# Altium schematic sheet STM32_SIM800C.SchDoc: Module Sim900A STM32
size A1
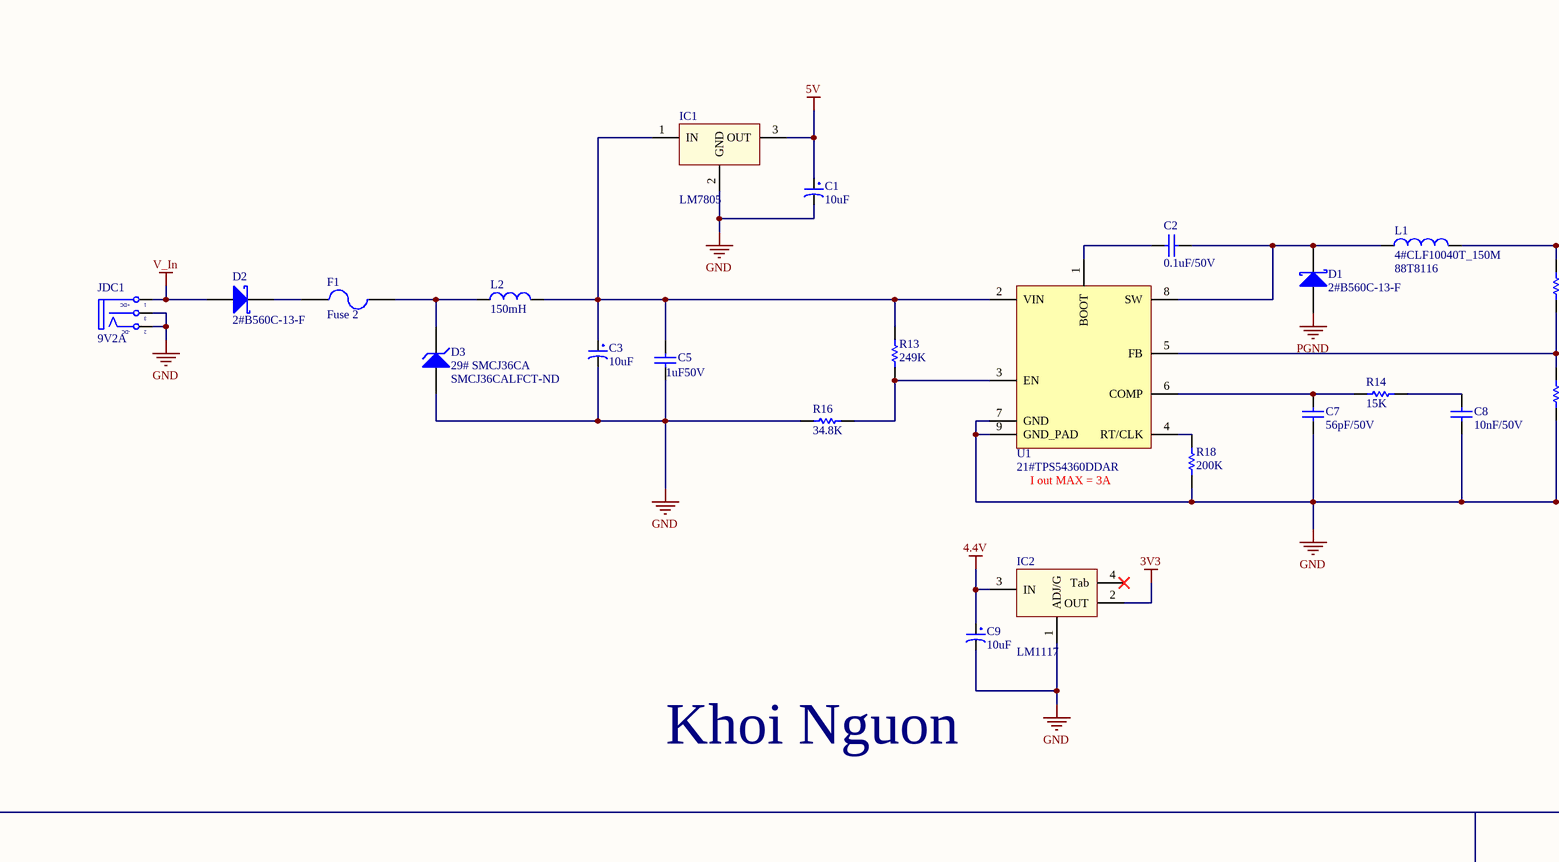
[diagram p0: STM32_SIM800C.SchDoc, top left]
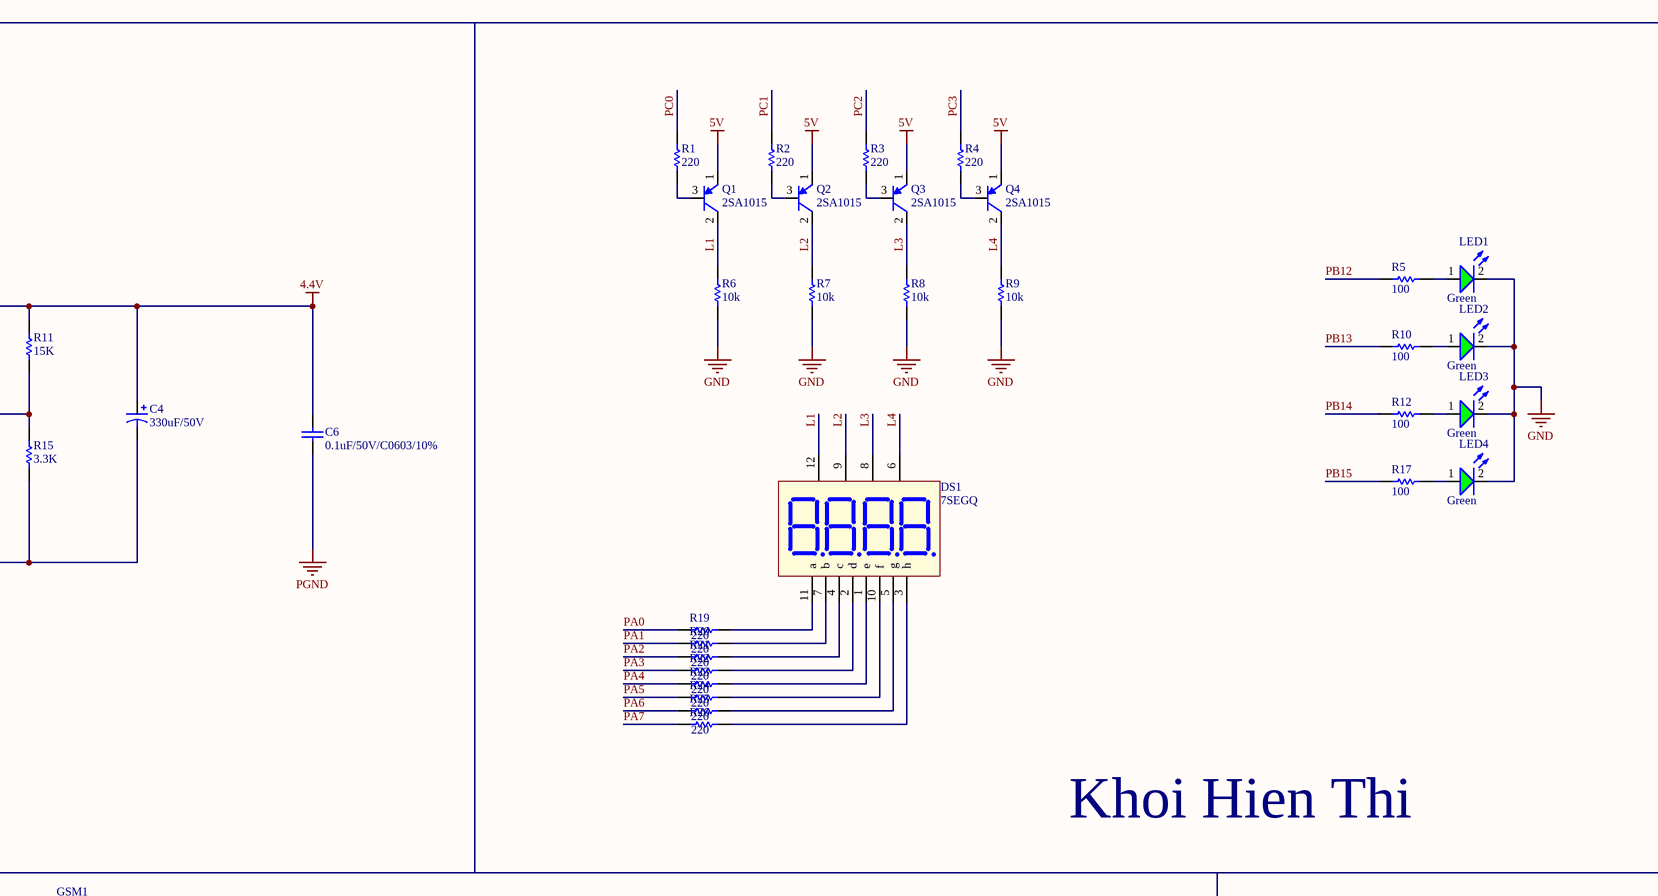
[diagram p1: STM32_SIM800C.SchDoc, top right]
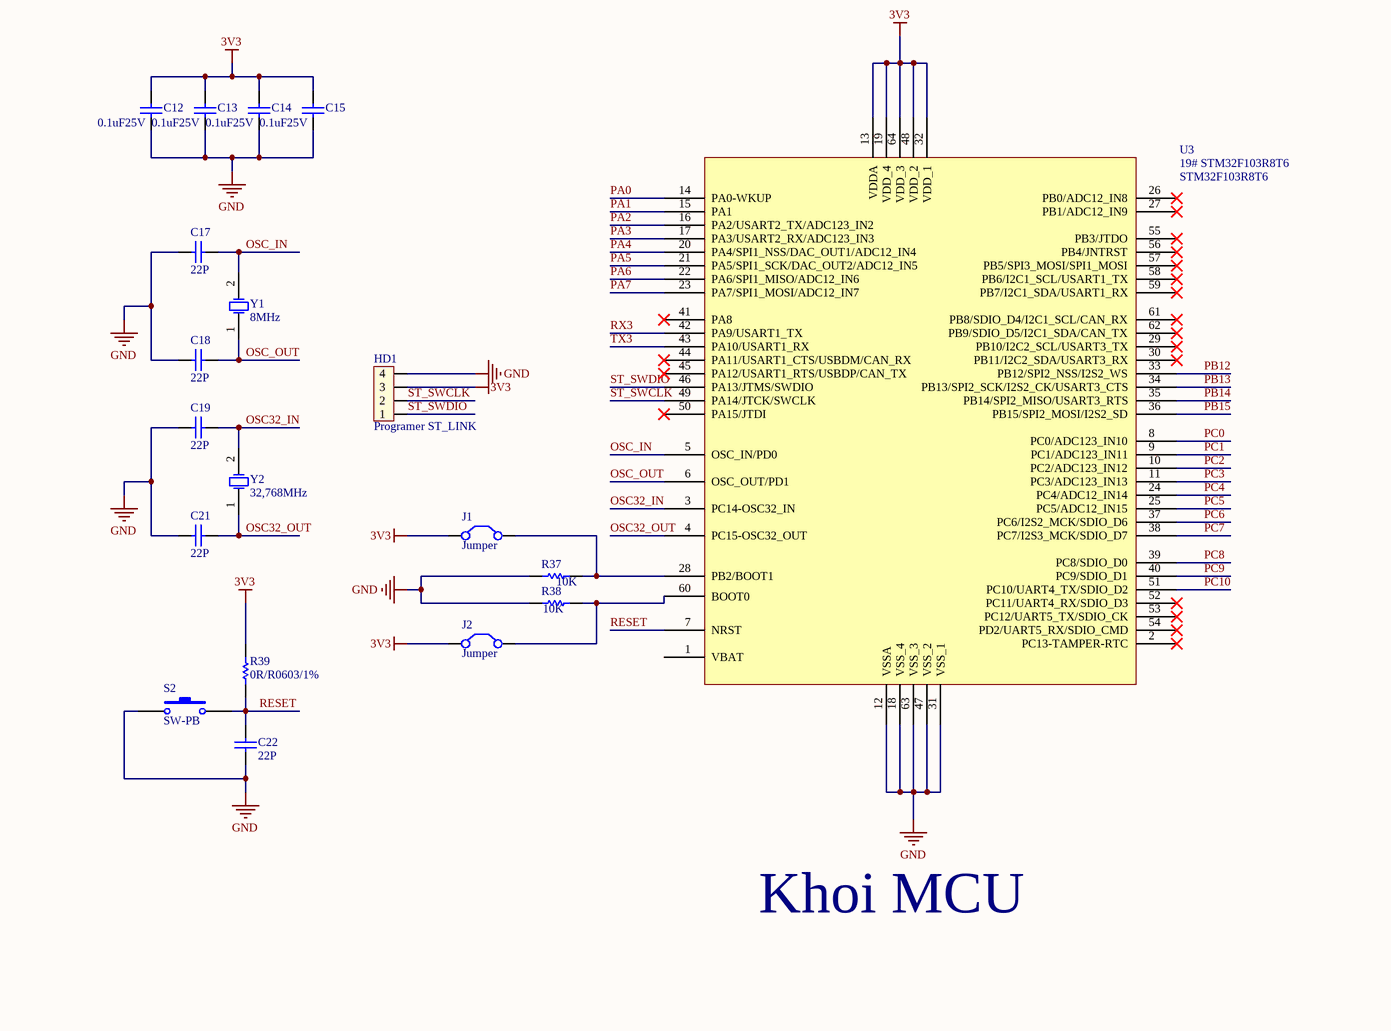
[diagram p2: STM32_SIM800C.SchDoc, bottom left]
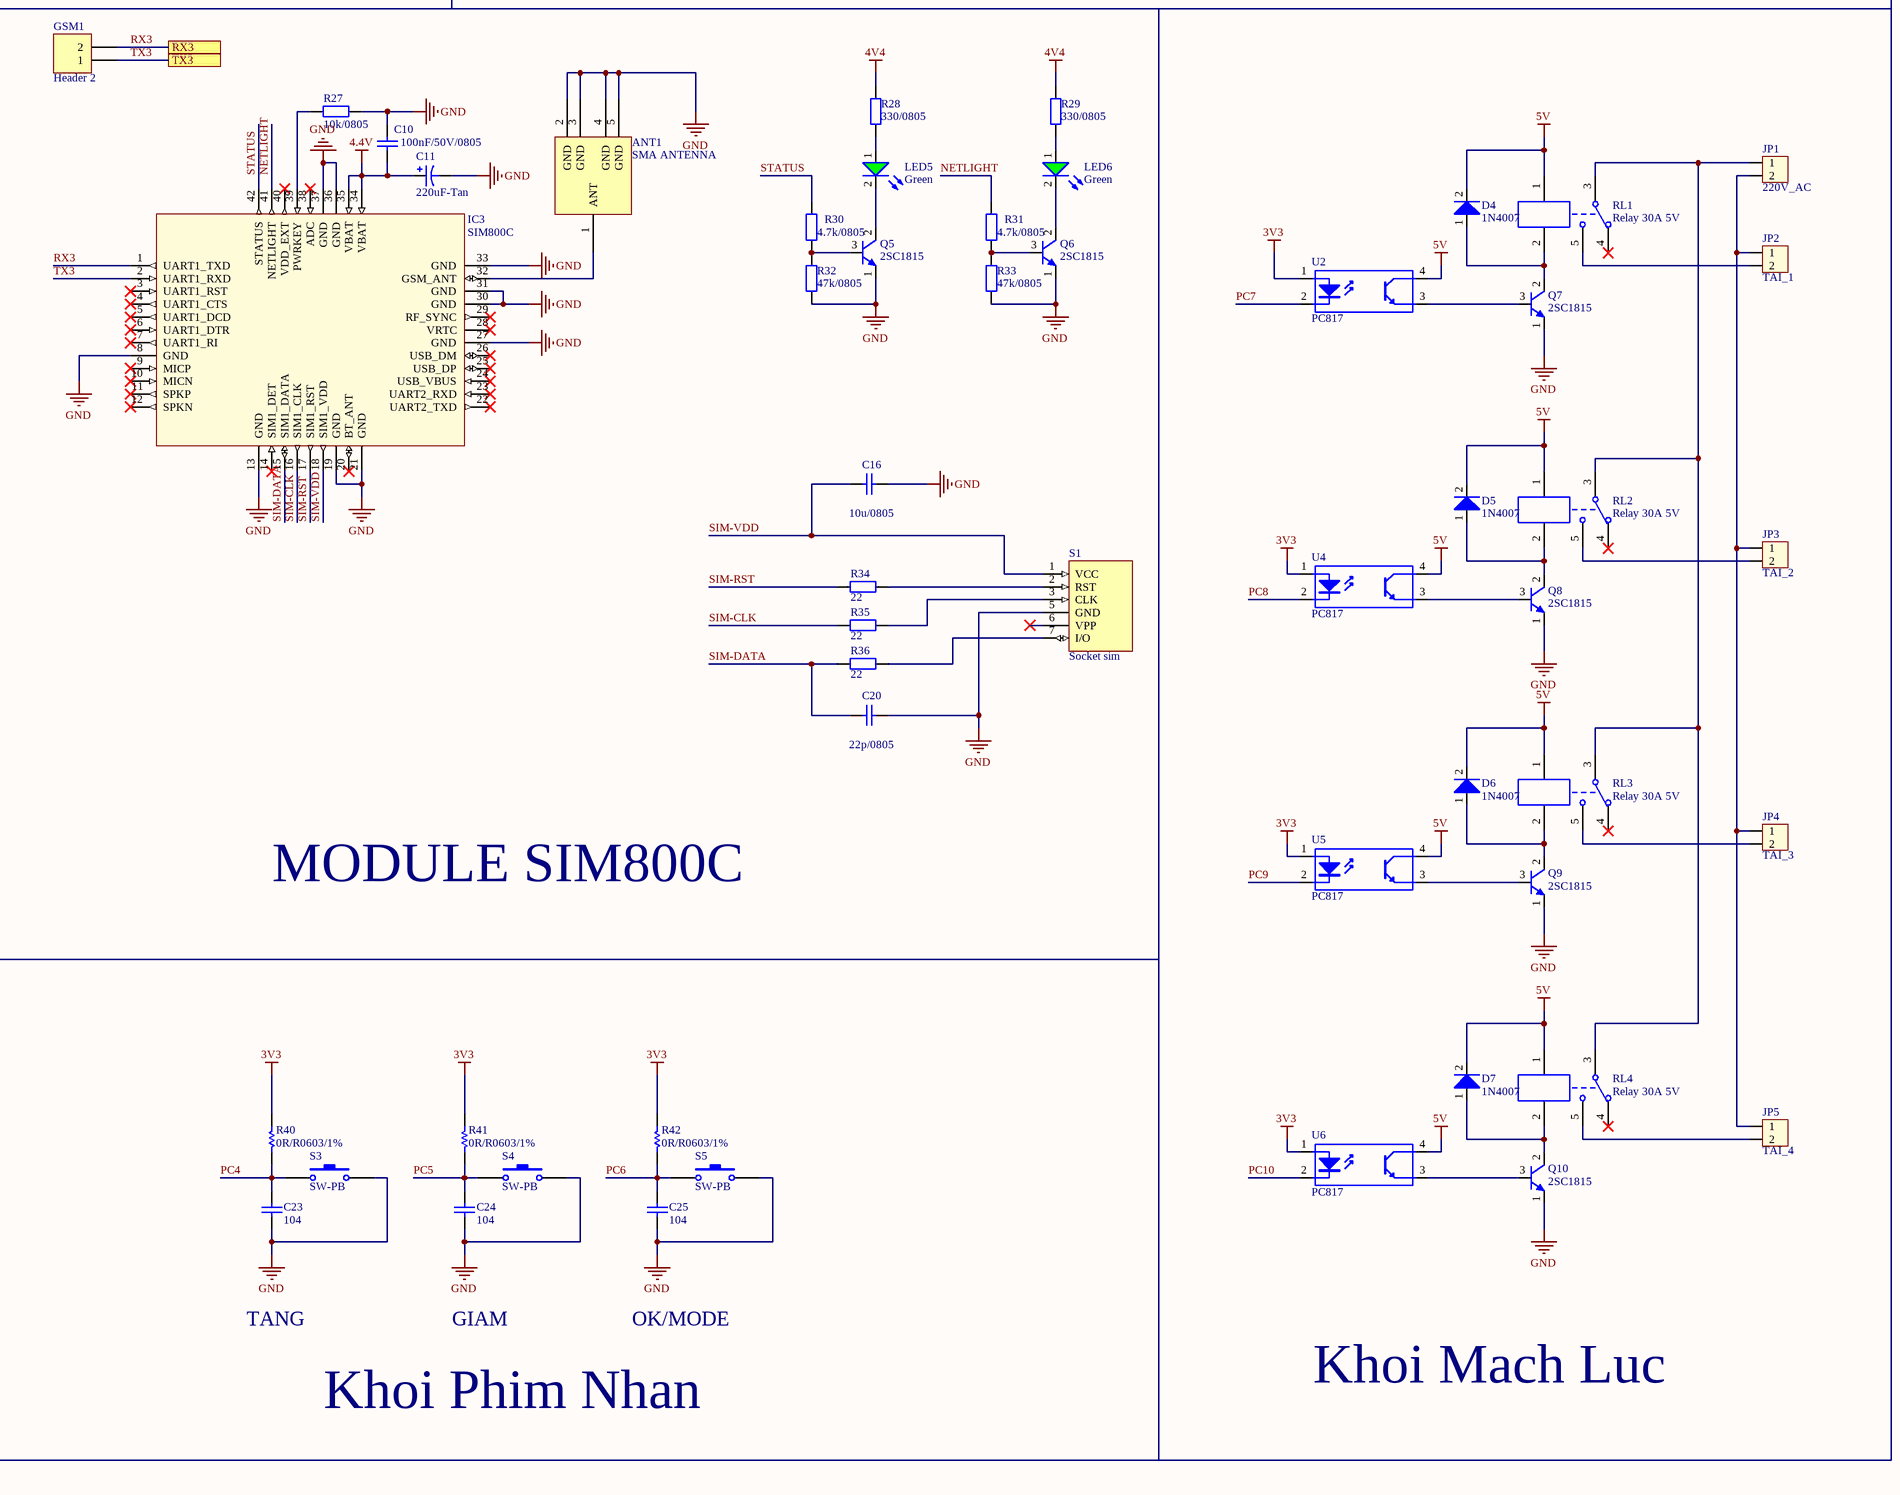
[diagram p3: STM32_SIM800C.SchDoc, bottom right]

## Parts
ANT1  SMA ANTENNA  [ANT-SMA-ST-F]
C1  10uF  [CP1/2]
C2  0.1uF/50V  [Cap Ceramic 0603 SMD]
C3  10uF  [CP1/2]
C4  330uF/50V  [CAP ALU CASE G SMD]
C5  1uF50V  [Cap Ceramic 0603 SMD]
C6  0.1uF/50V/C0603/10%  [Cap Ceramic 0603 SMD]
C7  56pF/50V  [Cap Ceramic 0603 SMD]
C8  10nF/50V  [Cap Ceramic 0603 SMD]
C9  10uF  [CP1/2]
C10  100nF/50V/0805  [C0805-2012]
C11  220uF-Tan  [CAP_TANTA_10UF_35V]
C12  0.1uF25V  [Cap Ceramic 0603 SMD]
C13  0.1uF25V  [Cap Ceramic 0603 SMD]
C14  0.1uF25V  [Cap Ceramic 0603 SMD]
C15  0.1uF25V  [Cap Ceramic 0603 SMD]
C16  10u/0805  [C0805-2012]
C17  22P  [Cap Ceramic 0603 SMD]
C18  22P  [Cap Ceramic 0603 SMD]
C19  22P  [Cap Ceramic 0603 SMD]
C20  22p/0805  [C0805-2012]
C21  22P  [Cap Ceramic 0603 SMD]
C22  22P  [Cap Ceramic 0603 SMD]
C23  104  [Cap Ceramic 0603 SMD]
C24  104  [Cap Ceramic 0603 SMD]
C25  104  [Cap Ceramic 0603 SMD]
D1  2#B560C-13-F  [2# B560C]
D2  2#B560C-13-F  [2# B560C]
D3  29# SMCJ36CA  Supplier Part Number 1: SMCJ36CALFCT-ND  [29# diode SMCJ36A]
D4  1N4007  [1N4007]
D5  1N4007  [1N4007]
D6  1N4007  [1N4007]
D7  1N4007  [1N4007]
DS1  7SEGQ  [7SEGQ]
F1  Fuse 2  [PIN-W2/E2.8]
GSM1  Header 2  [Header_2]
HD1  Programer ST_LINK  [Header_4]
IC1  LM7805  [QTO-220]
IC2  LM1117  [SOT223-4N]
IC3  SIM800C  [SIM800C]
J1  Jumper  [Header_2]
J2  Jumper  [Header_2]
JDC1  9V2A  [DC-IN]
JP1  220V_AC  [DOMINO_OSTTC_2P]
JP2  TAI_1  [DOMINO_OSTTC_2P]
JP3  TAI_2  [DOMINO_OSTTC_2P]
JP4  TAI_3  [DOMINO_OSTTC_2P]
JP5  TAI_4  [DOMINO_OSTTC_2P]
L1  4#CLF10040T_150M  Supplier Part Number 1: 88T8116  [4# clf10040XX]
L2  150mH  [L/0.4]
LED1  value Green  [LED5G]  (hidden comment: LT0054)
LED2  value Green  [LED5G]  (hidden comment: LT0054)
LED3  value Green  [LED5G]  (hidden comment: LT0054)
LED4  value Green  [LED5G]  (hidden comment: LT0054)
LED5  value Green  [LED5G]  (hidden comment: LT0054)
LED6  value Green  [LED5G]  (hidden comment: LT0054)
Q1  2SA1015  [2SA1015]
Q2  2SA1015  [2SA1015]
Q3  2SA1015  [2SA1015]
Q4  2SA1015  [2SA1015]
Q5  2SC1815  [2SC1815]
Q6  2SC1815  [2SC1815]
Q7  2SC1815  [2SC1815]
Q8  2SC1815  [2SC1815]
Q9  2SC1815  [2SC1815]
Q10  2SC1815  [2SC1815]
R1  220  [Res 0603 SMD]
R2  220  [Res 0603 SMD]
R3  220  [Res 0603 SMD]
R4  220  [Res 0603 SMD]
R5  100  [Res 0603 SMD]
R6  10k  [Res 0603 SMD]
R7  10k  [Res 0603 SMD]
R8  10k  [Res 0603 SMD]
R9  10k  [Res 0603 SMD]
R10  100  [Res 0603 SMD]
R11  15K  [Res 0603 SMD]
R12  100  [Res 0603 SMD]
R13  249K  [Res 0805 SMD]
R14  15K  [Res 0603 SMD]
R15  3.3K  [Cap Ceramic 0603 SMD]
R16  34.8K  [Res 0805 SMD]
R17  100  [Res 0603 SMD]
R18  200K  [Res 0603 SMD]
R19  220  [Res 0603 SMD]
R20  220  [Res 0603 SMD]
R21  220  [Res 0603 SMD]
R22  220  [Res 0603 SMD]
R23  220  [Res 0603 SMD]
R24  220  [Res 0603 SMD]
R25  220  [Res 0603 SMD]
R26  220  [Res 0603 SMD]
R27  10k/0805  [RESC2012(0805)]
R28  value 330/0805  [RESC2012(0805)]  (hidden comment: R0805)
R29  value 330/0805  [RESC2012(0805)]  (hidden comment: R0805)
R30  value 4.7k/0805  [RESC2012(0805)]  (hidden comment: R0805)
R31  value 4.7k/0805  [RESC2012(0805)]  (hidden comment: R0805)
R32  value 47k/0805  [RESC2012(0805)]  (hidden comment: R0805)
R33  value 47k/0805  [RESC2012(0805)]  (hidden comment: R0805)
R34  value 22  [RESC2012(0805)]  (hidden comment: R0805)
R35  value 22  [RESC2012(0805)]  (hidden comment: R0805)
R36  value 22  [RESC2012(0805)]  (hidden comment: R0805)
R37  10K  [Res 0603 SMD]
R38  10K  [Res 0603 SMD]
R39  0R/R0603/1%  [Res 0603 SMD]
R40  0R/R0603/1%  [Res 0603 SMD]
R41  0R/R0603/1%  [Res 0603 SMD]
R42  0R/R0603/1%  [Res 0603 SMD]
RL1  Relay 30A 5V  [RL_5V_30A]
RL2  Relay 30A 5V  [RL_5V_30A]
RL3  Relay 30A 5V  [RL_5V_30A]
RL4  Relay 30A 5V  [RL_5V_30A]
S1  Socket sim  [Card Sim]
S2  SW-PB  [SPST-2]
S3  SW-PB  [SPST-2]
S4  SW-PB  [SPST-2]
S5  SW-PB  [SPST-2]
U1  21#TPS54360DDAR  [21# TPS54360]
U2  PC817  [DIP-4]
U3  19# STM32F103R8T6  Supplier Part Number 1: STM32F103R8T6  [19# STMF103R8T6]
U4  PC817  [DIP-4]
U5  PC817  [DIP-4]
U6  PC817  [DIP-4]
Y1  8MHz  [CRYSTAL]
Y2  32,768MHz  [CRYSTAL]

## Ports
RX3, TX3

## Nets
3V3: C12.2 C13.2 C14.2 C15.2 HD1.3 IC2.2(OUT) J1.1(C1) J2.1(C1) R39.2 R40.2 R41.2 R42.2 U2.1(A) U3.13(VDDA) U3.19(VDD_4) U3.32(VDD_1) U3.48(VDD_2) U3.64(VDD_3) U4.1(A) U5.1(A) U6.1(A)
4.4V: C4.1 C6.2 C9.1 C10.1 C11.1 IC2.3(IN) IC3.34(VBAT) IC3.35(VBAT) L1.2 R11.2
4V4: R28.1 R29.1
5V: C1.1 D4.2(K) D5.2(K) D6.2(K) D7.2(K) IC1.3(OUT) Q1.1(E) Q2.1(E) Q3.1(E) Q4.1(E) RL1.1 RL2.1 RL3.1 RL4.1 U2.4(C) U4.4(C) U5.4(C) U6.4(C)
GND: ANT1.2(GND) ANT1.3(GND) ANT1.4(GND) ANT1.5(GND) C1.2 C3.2 C4.2 C5.1 C7.1 C8.1 C9.2 C10.2 C11.2 C12.1 C13.1 C14.1 C15.1 C16.2 C17.1 C18.1 C19.1 C20.2 C21.1 C22.1 C23.1 C24.1 C25.1 D3.1(A) HD1.4 IC1.2(GND) IC2.1(ADJ/G) IC3.8(GND) IC3.13(GND) IC3.19(GND) IC3.21(GND) IC3.27(GND) IC3.30(GND) IC3.31(GND) IC3.33(GND) IC3.36(GND) IC3.37(GND) JDC1.2(TN) JDC1.3(S) LED1.2(K) LED2.2(K) LED3.2(K) LED4.2(K) Q5.1(E) Q6.1(E) Q7.1(E) Q8.1(E) Q9.1(E) Q10.1(E) R6.1 R7.1 R8.1 R9.1 R15.1 R16.1 R18.2 R27.2 R32.2 R33.2 R37.2 R38.2 S1.5(GND) S2.1 S3.1 S4.1 S5.1 U1.7(GND) U1.9(GND_PAD) U3.12(VSSA) U3.18(VSS_4) U3.31(VSS_1) U3.47(VSS_2) U3.63(VSS_3)
PGND: C6.1 D1.1(A)
V_In: D2.1(A) JDC1.1(T)
L1: DS1.12(V1) Q1.2(C) R6.2
L2: DS1.9(V2) Q2.2(C) R7.2
L3: DS1.8(V3) Q3.2(C) R8.2
L4: DS1.6(V4) Q4.2(C) R9.2
NETLIGHT: IC3.41(NETLIGHT) R31.1
OSC32_IN: C19.2 U3.3(PC14-OSC32_IN) Y2.2(OSC2)
OSC32_OUT: C21.2 U3.4(PC15-OSC32_OUT) Y2.1(OSC1)
OSC_IN: C17.2 U3.5(OSC_IN/PD0) Y1.2(OSC2)
OSC_OUT: C18.2 U3.6(OSC_OUT/PD1) Y1.1(OSC1)
PA0: R19.2 U3.14(PA0-WKUP)
PA1: R20.2 U3.15(PA1)
PA2: R21.2 U3.16(PA2/USART2_TX/ADC123_IN2)
PA3: R22.2 U3.17(PA3/USART2_RX/ADC123_IN3)
PA4: R23.2 U3.20(PA4/SPI1_NSS/DAC_OUT1/ADC12_IN4)
PA5: R24.2 U3.21(PA5/SPI1_SCK/DAC_OUT2/ADC12_IN5)
PA6: R25.2 U3.22(PA6/SPI1_MISO/ADC12_IN6)
PA7: R26.2 U3.23(PA7/SPI1_MOSI/ADC12_IN7)
PB12: R5.2 U3.33(PB12/SPI2_NSS/I2S2_WS)
PB13: R10.2 U3.34(PB13/SPI2_SCK/I2S2_CK/USART3_CTS)
PB14: R12.2 U3.35(PB14/SPI2_MISO/USART3_RTS)
PB15: R17.2 U3.36(PB15/SPI2_MOSI/I2S2_SD)
PC0: R1.2 U3.8(PC0/ADC123_IN10)
PC1: R2.2 U3.9(PC1/ADC123_IN11)
PC2: R3.2 U3.10(PC2/ADC123_IN12)
PC3: R4.2 U3.11(PC3/ADC123_IN13)
PC4: C23.2 R40.1 S3.2 U3.24(PC4/ADC12_IN14)
PC5: C24.2 R41.1 S4.2 U3.25(PC5/ADC12_IN15)
PC6: C25.2 R42.1 S5.2 U3.37(PC6/I2S2_MCK/SDIO_D6)
PC7: U2.2(K) U3.38(PC7/I2S3_MCK/SDIO_D7)
PC8: U3.39(PC8/SDIO_D0) U4.2(K)
PC9: U3.40(PC9/SDIO_D1) U5.2(K)
PC10: U3.51(PC10/UART4_TX/SDIO_D2) U6.2(K)
RESET: C22.2 R39.1 S2.2 U3.7(NRST)
RX3: GSM1.2 IC3.1(UART1_TXD) U3.42(PA9/USART1_TX) ; port RX3
SIM-CLK: IC3.16(SIM1_CLK) R35.1
SIM-DATA: C20.1 IC3.15(SIM1_DATA) R36.1
SIM-RST: IC3.17(SIM1_RST) R34.1
SIM-VDD: C16.1 IC3.18(SIM1_VDD) S1.1(VCC)
ST_SWCLK: HD1.2 U3.49(PA14/JTCK/SWCLK)
ST_SWDIO: HD1.1 U3.46(PA13/JTMS/SWDIO)
STATUS: IC3.42(STATUS) R30.1
TX3: GSM1.1 IC3.2(UART1_RXD) U3.43(PA10/USART1_RX) ; port TX3
NetANT1_1: ANT1.1(ANT) IC3.32(GSM_ANT)
NetC2_1: C2.1 U1.1(BOOT)
NetC2_2: C2.2 D1.2(K) L1.1 U1.8(SW)
NetC3_1: C3.1 C5.2 IC1.1(IN) L2.2 R13.2 U1.2(VIN)
NetC7_2: C7.2 R14.2 U1.6(COMP)
NetC8_2: C8.2 R14.1
NetD2_2: D2.2(K) F1.1
NetD3_2: D3.2(K) F1.2 L2.1
NetD4_1: D4.1(A) Q7.2(C) RL1.2
NetD5_1: D5.1(A) Q8.2(C) RL2.2
NetD6_1: D6.1(A) Q9.2(C) RL3.2
NetD7_1: D7.1(A) Q10.2(C) RL4.2
NetDS1_1: DS1.1(e) R23.1
NetDS1_2: DS1.2(d) R22.1
NetDS1_3: DS1.3(h) R26.1
NetDS1_4: DS1.4(c) R21.1
NetDS1_5: DS1.5(g) R25.1
NetDS1_7: DS1.7(b) R20.1
NetDS1_10: DS1.10(f) R24.1
NetDS1_11: DS1.11(a) R19.1
NetIC3_39: IC3.39(PWRKEY) R27.1
NetJ1_2: J1.2(C2) R37.1 U3.28(PB2/BOOT1)
NetJ2_2: J2.2(C2) R38.1 U3.60(BOOT0)
NetJP1_1: JP1.1 RL1.3 RL2.3 RL3.3 RL4.3
NetJP1_2: JP1.2 JP2.1 JP3.1 JP4.1 JP5.1
NetJP2_2: JP2.2 RL1.5
NetJP3_2: JP3.2 RL2.5
NetJP4_2: JP4.2 RL3.5
NetJP5_2: JP5.2 RL4.5
NetLED1_1: LED1.1(A) R5.1
NetLED2_1: LED2.1(A) R10.1
NetLED3_1: LED3.1(A) R12.1
NetLED4_1: LED4.1(A) R17.1
NetLED5_1: LED5.1(A) R28.2
NetLED5_2: LED5.2(K) Q5.2(C)
NetLED6_1: LED6.1(A) R29.2
NetLED6_2: LED6.2(K) Q6.2(C)
NetQ1_3: Q1.3(B) R1.1
NetQ2_3: Q2.3(B) R2.1
NetQ3_3: Q3.3(B) R3.1
NetQ4_3: Q4.3(B) R4.1
NetQ5_3: Q5.3(B) R30.2 R32.1
NetQ6_3: Q6.3(B) R31.2 R33.1
NetQ7_3: Q7.3(B) U2.3(E)
NetQ8_3: Q8.3(B) U4.3(E)
NetQ9_3: Q9.3(B) U5.3(E)
NetQ10_3: Q10.3(B) U6.3(E)
NetR11_1: R11.1 R15.2 U1.5(FB)
NetR13_1: R13.1 R16.2 U1.3(EN)
NetR18_1: R18.1 U1.4(RT/CLK)
NetR34_2: R34.2 S1.2(RST)
NetR35_2: R35.2 S1.3(CLK)
NetR36_2: R36.2 S1.7(I/O)

Not connected (* = marked no-connect by the designer): IC2 4(Tab)*; IC3 3(UART1_RST)* 4(UART1_CTS)* 5(UART1_DCD)* 6(UART1_DTR)* 7(UART1_RI)* 9(MICP)* 10(MICN)* 11(SPKP)* 12(SPKN)* 14(SIM1_DET)* 20(BT_ANT)* 22(UART2_TXD)* 23(UART2_RXD)* 24(USB_VBUS)* 25(USB_DP)* 26(USB_DM)* 28(VRTC)* 29(RF_SYNC)* 38(ADC)* 40(VDD_EXT)*; RL1 4*; RL2 4*; RL3 4*; RL4 4*; S1 6(VPP)*; U3 1(VBAT) 2(PC13-TAMPER-RTC)* 26(PB0/ADC12_IN8)* 27(PB1/ADC12_IN9)* 29(PB10/I2C2_SCL/USART3_TX)* 30(PB11/I2C2_SDA/USART3_RX)* 41(PA8)* 44(PA11/USART1_CTS/USBDM/CAN_RX)* 45(PA12/USART1_RTS/USBDP/CAN_TX)* 50(PA15/JTDI)* 52(PC11/UART4_RX/SDIO_D3)* 53(PC12/UART5_TX/SDIO_CK)* 54(PD2/UART5_RX/SDIO_CMD)* 55(PB3/JTDO)* 56(PB4/JNTRST)* 57(PB5/SPI3_MOSI/SPI1_MOSI)* 58(PB6/I2C1_SCL/USART1_TX)* 59(PB7/I2C1_SDA/USART1_RX)* 61(PB8/SDIO_D4/I2C1_SCL/CAN_RX)* 62(PB9/SDIO_D5/I2C1_SDA/CAN_TX)*

## Notes on the sheet
- (near U1) I out MAX = 3A
- Khoi Nguon
- Khoi Hien Thi
- MODULE SIM800C
- Khoi MCU
- TANG
- GIAM
- OK/MODE
- Khoi Phim Nhan
- Khoi Mach Luc
- Title
- Size:
- Date:
- File:
- A1
- Number:
- Time:
- Revision:
- Sheet
- of
- (in symbol DCIN) +DC; -DC

## Library data of the parts
C1 C3 C9 = CP1: Cap P  0,1uF < 22uF , 16 - 50V; Value: 10uF/50V; Description 1: 10 => 220uF/6,3V/10V - 10uF => 100uF/16V; Description 2: 0,1uF => 33uF/50V - 10uF => 22uF/63V; Description 3: 0,47uF => 10uF/100V
C2 C5 C6 C12-C15 C17-C19 C21-C25 = 0.1uF/50V/C0603/10%: CAP CER 0.1UF 50V 10% X7R 0603; Manufacturer: Murata Electronics North America; Manufacturer Part Number: GRM188R71H104KA93D; Capacitance: 0.1µF; RoHS: RoHS Compliant; Category: Capacitors; Packaging: Tape & Reel (TR); Tolerance: ±10%; Voltage - Rated: 50V; Temperature Coefficient: X7R; Mounting Type: Surface Mount, MLCC; Operating Temperature: -55°C ~ 125°C; Applications: General Purpose; Ratings: -; Package / Case: 0603 (1608 Metric); Size / Dimension: 0.063" L x 0.031" W (1.60mm x 0.80mm); Height - Seated (Max): -; Thickness (Max): 0.035" (0.90mm); Lead Spacing: -; Features: -; Lead Style: -; ComponentLink1URL: http://www.murata.com/~/media/webrenewal/support/library/catalog/products/capacitor/mlcc/c02e.ashx; ComponentLink1Description: http://www.murata.com/~/media/webrenewal/support/library/catalog/products/capacitor/mlcc/c02e.ashx; Supplier 1: Digi-Key; Supplier Part Number 1: 490-1519-1-ND
C4 = 330uF/50V/ALU12.5X20mm/20%/7000Hrs: CAP ALU 330UF 20% 50V SMD; Manufacturer: Nichicon; Manufacturer Part Number: UPW1J331MHD; Lifetime @ Temp.: 7000 Hrs @ 105°C; Polarization: Polar; Ripple Current - Low Frequency: 838.5mA @ 120Hz; Ripple Current - High Frequency: 1.29A @ 100kHz; RoHS: RoHS Compliant; Category: Capacitors; Packaging: Bulk; Part Status: Active; Tolerance: ±20%; ESR (Equivalent Series Resistance): -; Operating Temperature: -55°C ~ 105°C; Applications: General Purpose; Lead Spacing: 0.197" (5.00mm); Size / Dimension: 0.492" Dia (12.50mm); Height - Seated (Max): 0.787" (20.00mm); Surface Mount Land Size: -; Mounting Type: Through Hole; Package / Case: Radial, Can; ComponentLink1URL: http://nichicon-us.com/english/products/pdfs/e-upw.pdf; ComponentLink1Description: http://nichicon-us.com/english/products/pdfs/e-upw.pdf; Supplier 1: Digi-Key; Supplier Part Number 1: PCE5121TR-ND
C7 = 56pF/50V/C0603/5%: Cap Ceramic 56pF 50V C0G 5% SMD 0603 125C Paper T/R; Manufacturer: Samsung; Manufacturer Part Number: CL10C560JB8NNNC; Temperature Coefficient: 30ppm/°C; Supplier 1: Digi-Key; Stock 1: 40000; Pricing 1: 1=0.1, 10=0.056, 100=0.0251, 500=0.0179, 1000=0.0141 (USD); Mount: Surface Mount; Case/Package: 0603; Case Code (Metric): 1608; Case Code (Imperial): 0603; Material: Ceramic; Min Operating Temperature: -55°C; Max Operating Temperature: 125°C; Capacitance: 56pF; Tolerance: 5%; Packaging: Tape and Reel; Voltage Rating: 50V; Package Quantity: 1; Dielectric: C0G; Voltage: 50V; Termination: SMD/SMT; Voltage Rating (DC): 50V; Length: 1.6mm; Height: 0.8mm; Width: 0.031inch; Thickness: 0.035inch; Depth: 0.8mm; Radiation Hardening: No; Lead Free: Lead Free; Supplier Part Number 1: 1276-1197-1-ND
C8 = 10nF/50V/C0603/10%: CAP CER 10000PF 50V X7R 0603; Manufacturer: Murata Electronics North America; Manufacturer Part Number: GRM188R71H103KA01D; Tolerance: ±10%; RoHS: RoHS Compliant; Category: Capacitors; Packaging: Cut Tape (CT); Capacitance: 10000pF; Voltage - Rated: 50V; Temperature Coefficient: X7R; Mounting Type: Surface Mount, MLCC; Operating Temperature: -55°C ~ 125°C; Applications: General Purpose; Ratings: -; Package / Case: 0603 (1608 Metric); Size / Dimension: 0.063" L x 0.031" W (1.60mm x 0.80mm); Height - Seated (Max): -; Thickness (Max): 0.035" (0.90mm); Lead Spacing: -; Features: -; Lead Style: -; ComponentLink1URL: http://www.murata.com/~/media/webrenewal/support/library/catalog/products/capacitor/mlcc/c02e.ashx; ComponentLink1Description: http://www.murata.com/~/media/webrenewal/support/library/catalog/products/capacitor/mlcc/c02e.ashx; Supplier 1: Digi-Key; Supplier Part Number 1: 490-1512-1-ND
C10 = CapSMD: Value: 33p; Published: 8-Jun-2000; LatestRevisionDate: 17-Jul-2002; LatestRevisionNote: Re-released for DXP Platform.; PackageReference: RAD-0.3; Publisher: Altium Limited
C11 = CAP1210-Tan
C16 C20 = CapSMD: Capacitor; Value: 33p; Published: 8-Jun-2000; LatestRevisionDate: 17-Jul-2002; LatestRevisionNote: Re-released for DXP Platform.; PackageReference: RAD-0.3; Publisher: Altium Limited
D1 D2 = 2#B560C-13-F: DIODE SCHOTTKY 60V 5A SMC; Manufacturer: Diodes; Peak Reverse Current: 500uA; Forward Voltage: 700mV; Max Forward Surge Current (Ifsm): 100A; Element Configuration: Single; Polarity: Standard; Capacitance: 300pF; Supplier 1: Digi-Key; Manufacturer Part Number: B560C-13-F; Stock 1: 183351; Pricing 1: 1=0.55, 10=0.467, 100=0.349, 500=0.2742, 1000=0.2119 (USD); Mount: Surface Mount; Case/Package: SMC; Number of Pins: 2; Weight: 0.007408oz; Contact Plating: Matte,Tin; Min Operating Temperature: -55°C; Max Operating Temperature: 125°C; Package Quantity: 3000; Packaging: Tape and Reel; Forward Current: 5A; Max Repetitive Reverse Voltage (Vrrm): 60V; Average Rectified Current: 5A; Peak Non-Repetitive Surge Current: 100A; Termination: SMD/SMT; Voltage Rating (DC): 60V; Current Rating: 5A; Output Current: 5A; Max Reverse Voltage (DC): 60V; Length: 7.11mm; Height: 2.5mm; Width: 6.22mm; Radiation Hardening: No; REACH SVHC: No SVHC; Lead Free: Lead Free; Supplier Part Number 1: B560C-FDICT-ND
D3 = 29# SMCJ36CA: TVS DIODE 36VWM 58.1VC SMC; Manufacturer: Littelfuse; Direction: Bidirectional; Reverse Breakdown Voltage: 40V; Operating Supply Voltage: 36V; Max Surge Current: 25.9A; Number of Bidirectional Channels: 1; Clamping Voltage: 58.1V; Peak Pulse Power: 1.5kW; Power Line Protection: No; Test Current: 1mA; Max Breakdown Voltage: 44.2V; Max Power Dissipation: 6.5W; Leakage Current: 1uA; Supplier 1: Digi-Key; Manufacturer Part Number: SMCJ36CA; Stock 1: 75326; Pricing 1: 1=0.7, 10=0.587, 25=0.514, 100=0.4406, 250=0.3818, 500=0.3231, 1000=0.2497 (USD); Mount: Surface Mount; Number of Pins: 2; Min Operating Temperature: -55°C; Max Operating Temperature: 150°C; Package Quantity: 3000; Packaging: Tape and Reel; Reverse Standoff Voltage: 36V; Min Breakdown Voltage: 40V; Breakdown Voltage: 40V; Number of Channels: 1; Polarity: Bidirectional; Termination: SMD/SMT; Number of Elements: 1; Peak Pulse Current: 25.9A; Power Dissipation: 1.5kW; Voltage Rating (DC): 36V; Composition: Zener; Length: 8.13mm; Height: 2.62mm; Width: 6.22mm; Radiation Hardening: No; REACH SVHC: No SVHC; Lead Free: Lead Free
D4-D7 = 1N4007: Diode LS 1A 1000V DO-41; ComponentLink1Description: Datasheet; ComponentLink1URL: D:\Dropbox\Datasheets\Diodes and Rectifiers\Diodes\1N400X.pdf; Unit Price: 0.0072
DS1 = LED7Q: Four 7 Seg Dipslay; Value: LED 7Q SEG
F1 = Fuse 2: Fuse; Published: 8-Jun-2000; LatestRevisionDate: 17-Jul-2002; LatestRevisionNote: Re-released for DXP Platform.; PackageReference: PIN-W2/E2.8; Publisher: Altium Limited; PackageDescription: Thru-Hole; 2 Leads
GSM1 = Header 2: Header, 2-Pin; LatestRevisionDate: 17-Jul-2002; LatestRevisionNote: Re-released for DXP Platform.; Publisher: Altium Limited
HD1 = Header4: Header 4; Value: Header 4
IC1 = LM78xx: On ap +, from + 5 to + 24VDC; Value: LM7805
IC2 = LM1117: 3v3; Value: LM317
IC3 = SIM800C: SIM800C V1.00
J1 J2 = Jumper: Jumper Wire; Published: 24-Mar-1999; LatestRevisionDate: 17-Jul-2002; LatestRevisionNote: Re-released for DXP Platform.; PackageReference: RAD-0.2; Publisher: Altium Limited; PackageDescription: Radial Cap, Thru-Hole; 2 Leads; 0.2 in Pin Spacing
JDC1 = DCIN: Jac DC input; Value: Jac DC
JP1-JP5 = Con2_1: Connector 2; Value: Connector 2
L1 = 4#CLF10040T_150M: FIXED IND 15uH 3.2A 40 MOHM (10.0×9.7×3.8); Supplier 1: Newark
L2 = L1: Inductor; Value: 150 mH
LED1-LED6 = LT0054: LED Green 20mA 2.2V 5mm; ComponentLink1Description: Datasheet; ComponentLink1URL: D:\Dropbox\Datasheets\Opto and Illumination\LEDs\LT0054.pdf; Unit Price: 0.0085
Q1-Q4 = 2SA1015: Trans PNP -50V -150mA TO-92; ComponentLink1Description: Datasheet; ComponentLink1URL: D:\Dropbox\Datasheets\Transistors\N Channel Bipolar\2SA1015.pdf; Unit Price: 0.0143
Q5-Q10 = 2SC1815: Trans NPN 50V 150mA TO-92; ComponentLink1Description: Datasheet; ComponentLink1URL: D:\Dropbox\Datasheets\Transistors\P Channel Bipolar\2SC1815.pdf; Unit Price: 0.0143
R1-R10 R12 R17 R19-R26 R37-R42 = 10K/R0603/1%: RES SMD 10K OHM 1% 1/10W 0603; Manufacturer: Yageo; Manufacturer Part Number: RC0603FR-0710KL; Power (Watts): 0.1W, 1/10W; Temperature Coefficient: ±100ppm/°C; Supplier 1: Digi-Key; RoHS: RoHS Compliant; Category: Resistors; Stock 1: 11440000; Pricing 1: 5000=0.00167, 10000=0.00145, 25000=0.00128, 50000=0.00117, 125000=0.00115 (USD); Packaging: Tape & Reel (TR); Resistance (Ohms): 10k; Tolerance: ±1%; Composition: Thick Film; Features: Moisture Resistant; Operating Temperature: -55°C ~ 155°C; Package / Case: 0603 (1608 Metric); Supplier Device Package: 0603; Size / Dimension: 0.063" L x 0.031" W (1.60mm x 0.80mm); Height: 0.022" (0.55mm); Number of Terminations: 2; ComponentLink1URL: http://www.yageo.com/NewPortal/yageodocoutput?fileName=/pdf/R-Chip/PYu-RC_Group_51_RoHS_L_3.pdf; ComponentLink1Description: http://www.yageo.com/NewPortal/yageodocoutput?fileName=/pdf/R-Chip/PYu-RC_Group_51_RoHS_L_3.pdf; Supplier Part Number 1: 311-10.0KHRTR-ND
R11 R14 = 15K/R0603/1%: RES SMD 15K OHM 1% 1/10W 0603; Manufacturer: Yageo; Manufacturer Part Number: RC0603FR-0715KL; Power (Watts): 0.1W, 1/10W; Temperature Coefficient: ±100ppm/°C; RoHS: RoHS Compliant; Category: Resistors; Packaging: Digi-Reel®; Resistance (Ohms): 15k; Tolerance: ±1%; Composition: Thick Film; Features: Moisture Resistant; Operating Temperature: -55°C ~ 155°C; Package / Case: 0603 (1608 Metric); Supplier Device Package: 0603; Size / Dimension: 0.063" L x 0.031" W (1.60mm x 0.80mm); Height: 0.022" (0.55mm); Number of Terminations: 2; ComponentLink1URL: http://www.yageo.com/NewPortal/yageodocoutput?fileName=/pdf/R-Chip/PYu-RC_Group_51_RoHS_L_3.pdf; ComponentLink1Description: http://www.yageo.com/NewPortal/yageodocoutput?fileName=/pdf/R-Chip/PYu-RC_Group_51_RoHS_L_3.pdf; Supplier 1: Digi-Key; Supplier Part Number 1: 311-15.0KHRCT-ND
R13 = 249K/R0805/1%: RES SMD 249K OHM 1% 1/10W 0805; Manufacturer: Yageo; Manufacturer Part Number: RC0603FR-07249KL; Power (Watts): 0.1W, 1/10W; Temperature Coefficient: ±100ppm/°C; Supplier 1: Digi-Key; RoHS: RoHS Compliant; Category: Resistors; Stock 1: 370515; Pricing 1: 1=0.1, 10=0.015, 100=0.006, 1000=0.00268, 2500=0.00233 (USD); Packaging: Cut Tape (CT); Part Status: Active; Tolerance: ±1%; Composition: Thick Film; Features: Moisture Resistant; Operating Temperature: -55°C ~ 155°C; Package / Case: 0603 (1608 Metric); Supplier Device Package: 0603; Size / Dimension: 0.063" L x 0.032" W (1.60mm x 0.80mm); Height - Seated (Max): 0.022" (0.55mm); Failure Rate: -; ComponentLink1URL: http://www.yageo.com/documents/recent/PYu-RC_Group_51_RoHS_L_8.pdf; ComponentLink1Description: http://www.yageo.com/documents/recent/PYu-RC_Group_51_RoHS_L_8.pdf
R15 = 3.3K/R0603/1%: RES SMD 3.3K OHM 1% 1/10W 0603; Manufacturer: Yageo; Manufacturer Part Number: RC0603FR-073K3L; Power (Watts): 0.1W, 1/10W; Temperature Coefficient: ±100ppm/°C; RoHS: RoHS Compliant; Category: Resistors; Packaging: Digi-Reel®; Resistance (Ohms): 3.3k; Tolerance: ±1%; Composition: Thick Film; Features: Moisture Resistant; Operating Temperature: -55°C ~ 155°C; Package / Case: 0603 (1608 Metric); Supplier Device Package: 0603; Size / Dimension: 0.063" L x 0.031" W (1.60mm x 0.80mm); Height: 0.022" (0.55mm); Number of Terminations: 2; ComponentLink1URL: http://www.yageo.com/NewPortal/yageodocoutput?fileName=/pdf/R-Chip/PYu-RC_Group_51_RoHS_L_3.pdf; ComponentLink1Description: http://www.yageo.com/NewPortal/yageodocoutput?fileName=/pdf/R-Chip/PYu-RC_Group_51_RoHS_L_3.pdf; Supplier 1: Digi-Key; Supplier Part Number 1: 311-3.30KHRCT-ND
R16 = 34.8K/R0805/1%: Thick Film Resistors - SMD 34.8K OHM 1% 0805; Manufacturer: Yageo; Manufacturer Part Number: RC0603FR-0734K8L; Power Rating: 100mW; Resistance: 34.8kR; Voltage Rating: 50V; Temperature Coefficient: 100ppm/°C; Supplier 1: Digi-Key; Stock 1: 82861; Pricing 1: 1=0.1, 10=0.026, 100=0.0107, 1000=0.0048, 2500=0.0042 (USD); Case/Package: 0603; Case Code (Imperial): 0603; Case Code (Metric): 1608; Min Operating Temperature: -55°C; Max Operating Temperature: 155°C; Tolerance: 1%; Packaging: Tape and Reel; Termination: SMD/SMT; Composition: Thick Film; Military Standard: Not; Voltage Rating (DC): 50V; Length: 1.6mm; Height: 0.45mm; Width: 0.8mm; Depth: 0.8mm; Lead Free: Lead Free; Supplier Part Number 1: 311-34.8KHRCT-ND
R18 = 200K/R0603/1%: RES SMD 200K OHM 1% 1/10W 0603; Manufacturer: Yageo; Manufacturer Part Number: RC0603FR-07200KL; Power (Watts): 0.1W, 1/10W; Temperature Coefficient: ±100ppm/°C; Supplier 1: Digi-Key; RoHS: RoHS Compliant; Category: Resistors; Stock 1: 924437; Pricing 1: 1=0.1, 10=0.015, 100=0.006, 1000=0.00268, 2500=0.00233 (USD); Packaging: Cut Tape (CT); Part Status: Active; Tolerance: ±1%; Composition: Thick Film; Features: Moisture Resistant; Operating Temperature: -55°C ~ 155°C; Package / Case: 0603 (1608 Metric); Supplier Device Package: 0603; Size / Dimension: 0.063" L x 0.031" W (1.60mm x 0.80mm); Height - Seated (Max): 0.022" (0.55mm); Failure Rate: -; ComponentLink1URL: http://www.yageo.com/documents/recent/PYu-RC_Group_51_RoHS_L_7.pdf; ComponentLink1Description: http://www.yageo.com/documents/recent/PYu-RC_Group_51_RoHS_L_7.pdf; Supplier Part Number 1: 311-200KHRCT-ND
R27-R36 = R0805: Resistor SMD 0805; Published: 8-Jun-2000; LatestRevisionDate: 17-Jul-2002; LatestRevisionNote: Re-released for DXP Platform.; PackageReference: AXIAL-0.4; Publisher: Altium Limited
RL1-RL4 = Relay T9GV5L14-5 30A 5V: Single-Pole Dual-Throw Relay; Published: 24-Mar-1999; LatestRevisionDate: 17-Jul-2002; LatestRevisionNote: Re-released for DXP Platform.; PackageReference: MODULE5B; Publisher: Altium Limited
S2-S5 = SW-PB: Switch; Published: 24-Mar-1999; LatestRevisionDate: 17-Jul-2002; LatestRevisionNote: Re-released for DXP Platform.; PackageReference: SPST-2; Publisher: Altium Limited; PackageDescription: Switch; 2 Leads
U1 = 21#TPS54360DDAR: Voltage Regulators - Switching Regulators 60 Vin,3.5 A,SD DC-DC Converter; Manufacturer: Texas Instruments; Output Current: 3.5A; Min Input Voltage: 4.5V; Number of Outputs: 1; Max Input Voltage: 60V; Output Voltage: 58.8V; Switching Frequency: 2.5MHz; Synchronous Rectifier: Yes; Min Output Voltage: 800mV; Quiescent Current: 146uA; Output Type: Adjustable; Output Configuration: Positive; Supplier 1: Digi-Key; Manufacturer Part Number: TPS54360DDAR; Stock 1: 40955; Pricing 1: 1=4.32, 10=3.883, 100=3.1815, 500=2.7083, 1000=2.2841 (USD); Mount: Surface Mount; Number of Pins: 8; Contact Plating: Gold; Min Operating Temperature: -40°C; Max Operating Temperature: 125°C; Packaging: Tape and Reel; Package Quantity: 2500; Max Output Current: 3.5A; Max Output Voltage: 58.8V; Operating Supply Voltage: 60V; Radiation Hardening: No; REACH SVHC: No SVHC; Lead Free: Lead Free; Supplier Part Number 1: 296-37676-1-ND; Case/Package: DDA R-PDSO-G8
U2 U4-U6 = Optoisolator1: 4-Pin Phototransistor Optocoupler; Published: 24-Mar-1999; LatestRevisionDate: 04-Mar-2005; LatestRevisionNote: Sch pins 3 & 4 Swapped.; DatasheetVersion: Nov-2003; PackageReference: DIP-4; Publisher: Altium Limited
U3 = 19# STM32F103R8T6: STM32 ARM-based 32-bit MCU with ARM 32-bit Cortex-M3 Microcontroller, 64 Kbytes Flash, 64-pin LQFP, Industrial Temperature; UART: 5; I2C: 2; SPI/I2S: 3; USB 2.0: 1; ARM Core: Cortex M3; Published: 30-May-2008; DatasheetVersion: rev6, Mar-2008; PackageVersion: Mar-2008; PackageReference: LQFP64; Publisher: Altium Limited; PackageDescription: 64-Pin Low-Profile Quad Flat Pack, 10 x 10 mm Body, 0.5 mm Pitch (LQFP64); ComponentLink1Description: Manufacturer Link; ComponentLink1URL: www.st.com/stm32; ComponentLink2Description: Datasheet; ComponentLink2URL: http://www.st.com/stonline/products/literature/ds/13587.pdf; CAN 2.0: 1; ADC: 3; DAC: 2; Case/Package: LQFP - 64; Supplier 1: Future Electronics
Y1 Y2 = XTAL_12MHz: Crystal Oscillator; Published: 8-Jun-2000; LatestRevisionDate: 17-Jul-2002; LatestRevisionNote: Re-released for DXP Platform.; PackageReference: R38; Publisher: Altium Limited; PackageDescription: Crystal, Thru-Hole; 2 Leads; Body 3.1 x 8.2 mm (Dia.xH)